# Altium schematic sheet 4.IMU.SchDoc
size A; DocumentNumber: 4; SheetNumber: 4; SheetTotal: 6
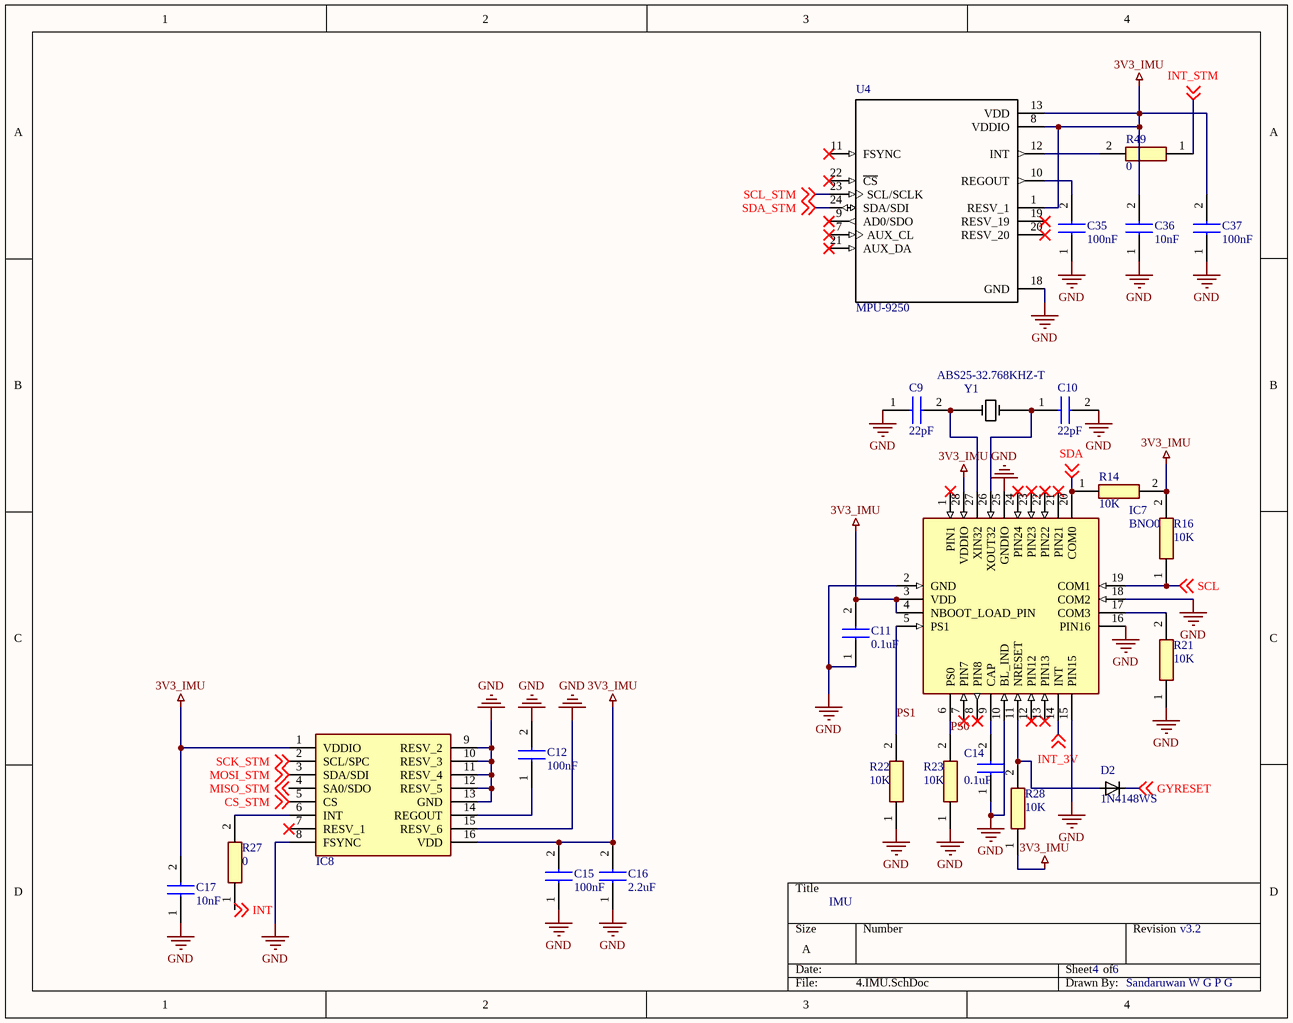
[diagram p0: 4.IMU.SchDoc]

## Parts
C9  value 22pF  [*CAPC1608X95N]  (hidden comment: capacitor 0603)
C10  value 22pF  [*CAPC1608X95N]  (hidden comment: capacitor 0603)
C11  value 0.1uF  [*CAPC1608X95N]  (hidden comment: capacitor 0603)
C12  value 100nF  [*CAPC1608X95N]  (hidden comment: capacitor 0603)
C14  value 0.1uF  [*CAPC1608X95N]  (hidden comment: capacitor 0603)
C15  value 100nF  [*CAPC1608X95N]  (hidden comment: capacitor 0603)
C16  value 2.2uF  [*CAPC1608X95N]  (hidden comment: capacitor 0603)
C17  value 10nF  [*CAPC1608X95N]  (hidden comment: capacitor 0603)
C35  value 100nF  [*CAPC1608X95N]  (hidden comment: capacitor 0603)
C36  value 10nF  [*CAPC1608X95N]  (hidden comment: capacitor 0603)
C37  value 100nF  [*CAPC1608X95N]  (hidden comment: capacitor 0603)
D2  1N4148WS  [*SOD323_1N4148WS(Primary)]
IC7  BNO055  [BNO055]
IC8  ICM20602  [PULL-BACK-QFN-16]  (value not drawn)
R14  value 10K  [RESC1608X55N]  (hidden comment: resistor)
R16  value 10K  [RESC1608X55N]  (hidden comment: resistor)
R21  value 10K  [RESC1608X55N]  (hidden comment: resistor)
R22  value 10K  [RESC1608X55N]  (hidden comment: resistor)
R23  value 10K  [RESC1608X55N]  (hidden comment: resistor)
R27  value 0  [RESC1608X55N]  (hidden comment: resistor)
R28  value 10K  [RESC1608X55N]  (hidden comment: resistor)
R49  value 0  [RESC1608X55N]  (hidden comment: resistor)
U4  MPU-9250  [*QFN40P300X300X105-24N]
Y1  ABS25-32.768KHZ-T  [*XTAL_ABS25-32.768KHZ-6-1-T]

## Nets
3V3_IMU: C11.2 C15.2 C16.2 C17.2 C36.2 C37.2 IC7.3(VDD) IC7.4(NBOOT_LOAD_PIN) IC7.28(VDDIO) IC8.1(VDDIO) IC8.16(VDD) R14.2 R16.2 R28.1 U4.1(RESV_1) U4.8(VDDIO) U4.13(VDD)
GND: C9.1 C10.2 C11.1 C12.2 C14.1 C15.1 C16.1 C17.1 C35.1 C36.1 C37.1 IC7.2(GND) IC7.10(BL_IND) IC7.15(PIN15) IC7.16(PIN16) IC7.18(COM2) IC7.25(GNDIO) IC8.8(FSYNC) IC8.9(RESV_2) IC8.10(RESV_3) IC8.11(RESV_4) IC8.12(RESV_5) IC8.13(GND) IC8.15(RESV_6) R21.1 R22.1 R23.1 U4.18(GND)
CS_STM: IC8.5(CS) ; off-sheet CS_STM
GYRESET: D2.C ; off-sheet GYRESET
INT: R27.1 ; off-sheet INT
INT_3V: IC7.14(INT) ; off-sheet INT_3V
INT_STM: R49.1 ; off-sheet INT_STM
MISO_STM: IC8.4(SA0/SDO) ; off-sheet MISO_STM
MOSI_STM: IC8.3(SDA/SDI) ; off-sheet MOSI_STM
PS0: IC7.6(PS0) R23.2
PS1: IC7.5(PS1) R22.2
SCK_STM: IC8.2(SCL/SPC) ; off-sheet SCK_STM
SCL: IC7.19(COM1) R16.1 ; off-sheet SCL
SCL_STM: U4.23(SCL/SCLK) ; off-sheet SCL_STM
SDA: IC7.20(COM0) R14.1 ; off-sheet SDA
SDA_STM: U4.24(SDA/SDI) ; off-sheet SDA_STM
NetC9_2: C9.2 IC7.27(XIN32) Y1.4
NetC10_1: C10.1 IC7.26(XOUT32) Y1.1
NetC12_1: C12.1 IC8.14(REGOUT)
NetC14_2: C14.2 IC7.9(CAP)
NetC35_2: C35.2 U4.10(REGOUT)
NetD2_A: D2.A IC7.11(NRESET) R28.2
NetIC7_17: IC7.17(COM3) R21.2
NetIC8_6: IC8.6(INT) R27.2
NetR49_2: R49.2 U4.12(INT)

Not connected (* = marked no-connect by the designer): IC7 1(PIN1)* 7(PIN7)* 8(PIN8)* 12(PIN12)* 13(PIN13)* 21(PIN21)* 22(PIN22)* 23(PIN23)* 24(PIN24)*; IC8 7(RESV_1)*; U4 7(AUX_CL)* 9(AD0/SDO)* 11(FSYNC)* 19(RESV_19)* 20(RESV_20)* 21(AUX_DA)* 22(~{CS})*

## Notes on the sheet
- IMU
- v3.2
- Sandaruwan W G P G

## Library data of the parts
C9-C12 C14-C17 C35-C37 = capacitor 0603: Capacitor
D2 = 1N4148WS: Diode Switching 75V 0.3A 2-Pin SOD-323 T/R; MF: ON Semiconductor; Price: None; Package: S-0 Good-Ark; MP: 1N4148WS; Availability: Unavailable; SnapEDA_Link: https://www.snapeda.com/parts/1N4148WS/ON%20Semiconductor/view-part/?ref=snap; Value: *
IC7 = BNO055: Integrated Circuit; Manufacturer_Name: Bosch Sensortec; Datasheet Link: https://ae-bst.resource.bosch.com/media/_tech/media/datasheets/BST_BNO055_DS000_14.pdf; Height: 1mm; Manufacturer_Part_Number: BNO055; Mouser Part Number: 262-BNO055; Mouser Price/Stock: https://www.mouser.com/Search/Refine.aspx?Keyword=262-BNO055
IC8 = ICM20602: Integrated Circuit
U4 = MPU-9250: IMUs - Inertial Measurement Units RECOMMENDED ALT 410-ICM-20948; MF: TDK InvenSense; Package: TFQFN-24 TDK InvenSense; Availability: Unavailable; MP: MPU-9250; SnapEDA_Link: https://www.snapeda.com/parts/MPU-9250/TDK%20InvenSense/view-part/?ref=snap; Price: None; Value: *
Y1 = ABS25-32.768KHZ-T: 32.768 Mhz Plastic Smt Low Pro; MF: Abracon LLC; Price: None; Package: None; MP: ABS25-32.768KHZ; Availability: Unavailable; SnapEDA_Link: https://www.snapeda.com/parts/ABS25-32.768KHZ/Abracon%20LLC/view-part/?ref=snap; Value: *